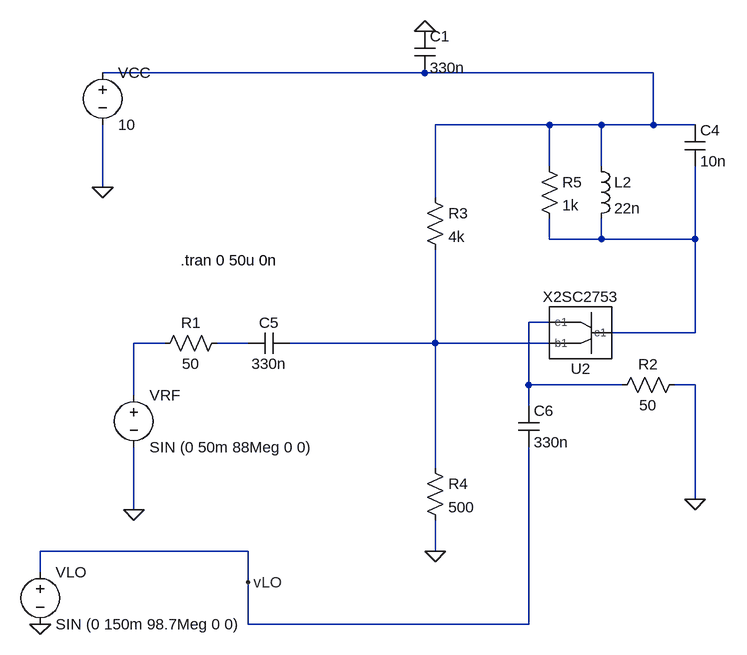
[diagram p0: schematic Mixer.asc]
Mixer.asc, the LTspice schematic file:
Version 4
SHEET 1 880 680
WIRE -1904 -560 -2400 -560
WIRE -1552 -560 -1904 -560
WIRE -1712 -480 -1888 -480
WIRE -1632 -480 -1712 -480
WIRE -1552 -480 -1552 -560
WIRE -1552 -480 -1632 -480
WIRE -1488 -480 -1552 -480
WIRE -1712 -416 -1712 -480
WIRE -1632 -416 -1632 -480
WIRE -2400 -384 -2400 -480
WIRE -1888 -368 -1888 -480
WIRE -1712 -304 -1712 -336
WIRE -1632 -304 -1632 -336
WIRE -1632 -304 -1712 -304
WIRE -1488 -304 -1488 -416
WIRE -1488 -304 -1632 -304
WIRE -1712 -176 -1744 -176
WIRE -1488 -160 -1488 -304
WIRE -1488 -160 -1616 -160
WIRE -2304 -144 -2352 -144
WIRE -2176 -144 -2224 -144
WIRE -1888 -144 -1888 -288
WIRE -1888 -144 -2112 -144
WIRE -1712 -144 -1888 -144
WIRE -1744 -80 -1744 -176
WIRE -1600 -80 -1744 -80
WIRE -1488 -80 -1520 -80
WIRE -2352 -64 -2352 -144
WIRE -1744 -48 -1744 -80
WIRE -1888 48 -1888 -144
WIRE -1488 96 -1488 -80
WIRE -2352 112 -2352 16
WIRE -2176 176 -2496 176
WIRE -1888 176 -1888 128
WIRE -2496 208 -2496 176
WIRE -2176 224 -2176 176
WIRE -2176 288 -2176 224
WIRE -1744 288 -1744 16
WIRE -1744 288 -2176 288
FLAG -2352 112 0
FLAG -1888 176 0
FLAG -1488 96 0
FLAG -2400 -384 0
FLAG -2176 224 vLO
FLAG -2496 288 0
FLAG -1904 -624 0
SYMBOL ind -1648 -432 R0
SYMATTR InstName L2
SYMATTR Value 22n
SYMBOL cap -1504 -480 R0
SYMATTR InstName C4
SYMATTR Value 10n
SYMBOL cap -2112 -160 R90
WINDOW 0 0 32 VBottom 2
WINDOW 3 32 32 VTop 2
SYMATTR InstName C5
SYMATTR Value 330n
SYMBOL res -1904 -384 R0
SYMATTR InstName R3
SYMATTR Value 4k
SYMBOL res -1904 32 R0
SYMATTR InstName R4
SYMATTR Value 500
SYMBOL X2SC2753 -1664 -160 R180
SYMATTR InstName U2
SYMBOL cap -1760 -48 R0
SYMATTR InstName C6
SYMATTR Value 330n
SYMBOL voltage -2352 -80 R0
SYMATTR InstName VRF
SYMATTR Value SIN (0 50m 88Meg 0 0)
SYMBOL voltage -2400 -576 R0
SYMATTR InstName VCC
SYMATTR Value 10
SYMBOL voltage -2496 192 R0
SYMATTR InstName VLO
SYMATTR Value SIN (0 150m 98.7Meg 0 0)
SYMBOL res -2208 -160 R90
WINDOW 0 0 56 VBottom 2
WINDOW 3 32 56 VTop 2
SYMATTR InstName R1
SYMATTR Value 50
SYMBOL res -1504 -96 R90
WINDOW 0 0 56 VBottom 2
WINDOW 3 32 56 VTop 2
SYMATTR InstName R2
SYMATTR Value 50
SYMBOL cap -1920 -624 R0
SYMATTR InstName C1
SYMATTR Value 330n
SYMBOL res -1728 -432 R0
SYMATTR InstName R5
SYMATTR Value 1k
TEXT -2280 -272 Left 2 !.tran 0 50u 0n

The netlist it stands for:
* Mixer.asc
L2 N001 N002 22n
C4 N001 N002 10n
C5 N006 N005 330n
R3 N001 N006 4k
R4 N006 0 500
XU2 N002 N006 N003 X2SC2753  ; pins c1 b1 e1
C6 N003 vLO 330n
VRF N004 0 SIN (0 50m 88Meg 0 0)
VCC N001 0 10
VLO vLO 0 SIN (0 150m 98.7Meg 0 0)
R1 N005 N004 50
R2 0 N003 50
C1 0 N001 330n
R5 N001 N002 1k
.tran 0 50u 0n
.lib C:/Users/jonathansharir-smith/Desktop/251SPICE/Lab2/narrowband\2SC2753.lib
.backanno
.end